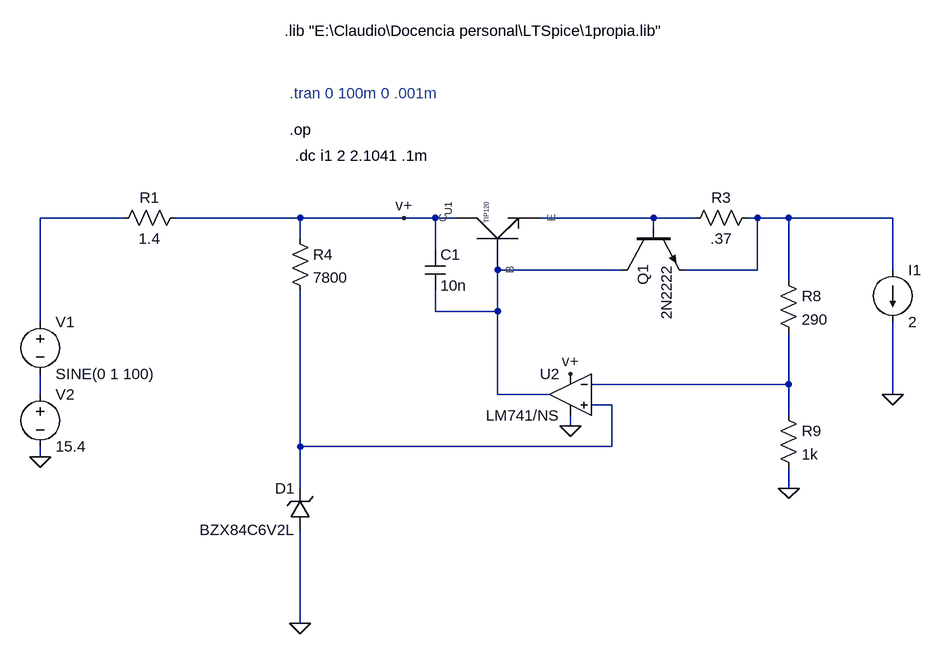
[diagram p0: schematic fuente clase 3.asc]
fuente clase 3.asc, the LTspice schematic file:
Version 4
SHEET 1 1284 868
WIRE 16 224 -112 224
WIRE 288 224 96 224
WIRE 448 224 288 224
WIRE 496 224 448 224
WIRE 528 224 496 224
WIRE 832 224 656 224
WIRE 896 224 832 224
WIRE 992 224 976 224
WIRE 1040 224 992 224
WIRE 1200 224 1040 224
WIRE 832 240 832 224
WIRE 288 256 288 224
WIRE 496 272 496 224
WIRE 784 304 592 304
WIRE 992 304 992 224
WIRE 992 304 880 304
WIRE 1200 304 1200 224
WIRE 1040 320 1040 224
WIRE 496 368 496 336
WIRE 592 368 592 304
WIRE 592 368 496 368
WIRE -112 384 -112 224
WIRE 1040 480 1040 400
WIRE 1040 480 736 480
WIRE -112 496 -112 464
WIRE 592 496 592 368
WIRE 672 496 592 496
WIRE 1200 496 1200 384
WIRE 768 512 736 512
WIRE 1040 528 1040 480
WIRE 704 544 704 528
WIRE 288 576 288 336
WIRE 768 576 768 512
WIRE 768 576 288 576
WIRE -112 592 -112 576
WIRE 288 640 288 576
WIRE 1040 640 1040 608
WIRE 288 848 288 704
FLAG 704 544 0
FLAG 704 464 v+
FLAG 448 224 v+
FLAG 288 848 0
FLAG 1040 640 0
FLAG -112 592 0
FLAG 1200 496 0
DATAFLAG 944 368 ""
DATAFLAG -80 224 ""
DATAFLAG 1104 224 ""
SYMBOL Propia\\Darlington\ npn 592 256 R270
SYMATTR Value TIP120
SYMATTR InstName U1
SYMBOL res 272 240 R0
SYMATTR InstName R4
SYMATTR Value 7800
SYMBOL zener 304 704 R180
WINDOW 0 24 64 Left 2
WINDOW 3 24 0 Left 2
SYMATTR InstName D1
SYMATTR Value BZX84C6V2L
SYMBOL OpAmps\\opamp2 704 432 M0
SYMATTR InstName U2
SYMATTR Value LM741/NS
SYMBOL res 1024 304 R0
SYMATTR InstName R8
SYMATTR Value 290
SYMBOL res 1024 512 R0
SYMATTR InstName R9
SYMATTR Value 1k
SYMBOL voltage -112 368 R0
WINDOW 123 0 0 Left 0
WINDOW 39 0 0 Left 0
SYMATTR InstName V1
SYMATTR Value SINE(0 1 100)
SYMBOL voltage -112 480 R0
WINDOW 123 0 0 Left 0
WINDOW 39 0 0 Left 0
SYMATTR InstName V2
SYMATTR Value 15.4
SYMBOL res 112 208 R90
WINDOW 0 0 56 VBottom 2
WINDOW 3 32 56 VTop 2
SYMATTR InstName R1
SYMATTR Value 1.4
SYMBOL cap 480 272 R0
SYMATTR InstName C1
SYMATTR Value 10n
SYMBOL npn 784 240 M90
SYMATTR InstName Q1
SYMATTR Value 2N2222
SYMBOL res 992 208 R90
WINDOW 0 0 56 VBottom 2
WINDOW 3 32 56 VTop 2
SYMATTR InstName R3
SYMATTR Value .37
SYMBOL current 1200 304 R0
WINDOW 123 0 0 Left 0
WINDOW 39 0 0 Left 0
SYMATTR InstName I1
SYMATTR Value 2
TEXT 272 32 Left 2 ;.tran 0 100m 0 .001m
TEXT 264 -64 Left 2 !.lib "E:\\Claudio\\Docencia personal\\LTSpice\\1propia.lib"
TEXT 272 88 Left 2 !.op
TEXT 280 128 Left 2 !.dc i1 2 2.1041 .1m

The netlist it stands for:
* fuente clase 3.asc
XU1 v+ N004 N002 TIP120  ; pins C B E
R4 v+ N007 7800
D1 0 N007 BZX84C6V2L
XU2 N007 N005 v+ 0 N004 LM741/NS  ; pins In+ In- V+ V- OUT
R8 N003 N005 290
R9 N005 0 1k
V1 N001 N006 SINE(0 1 100)
V2 N006 0 15.4
R1 v+ N001 1.4
C1 v+ N004 10n
Q1 N004 N002 N003 0 2N2222
R3 N003 N002 .37
I1 N003 0 2
.model D D
.lib standard.dio
.model NPN NPN
.model PNP PNP
.lib standard.bjt
* .tran 0 100m 0 .001m
.lib "E:\Claudio\Docencia personal\LTSpice\1propia.lib"
.op
.dc i1 2 2.1041 .1m
.backanno
.end